# EAGLE schematic LAB_20200609_0_LightSensorWithNPN (EAGLE 9.3.2)
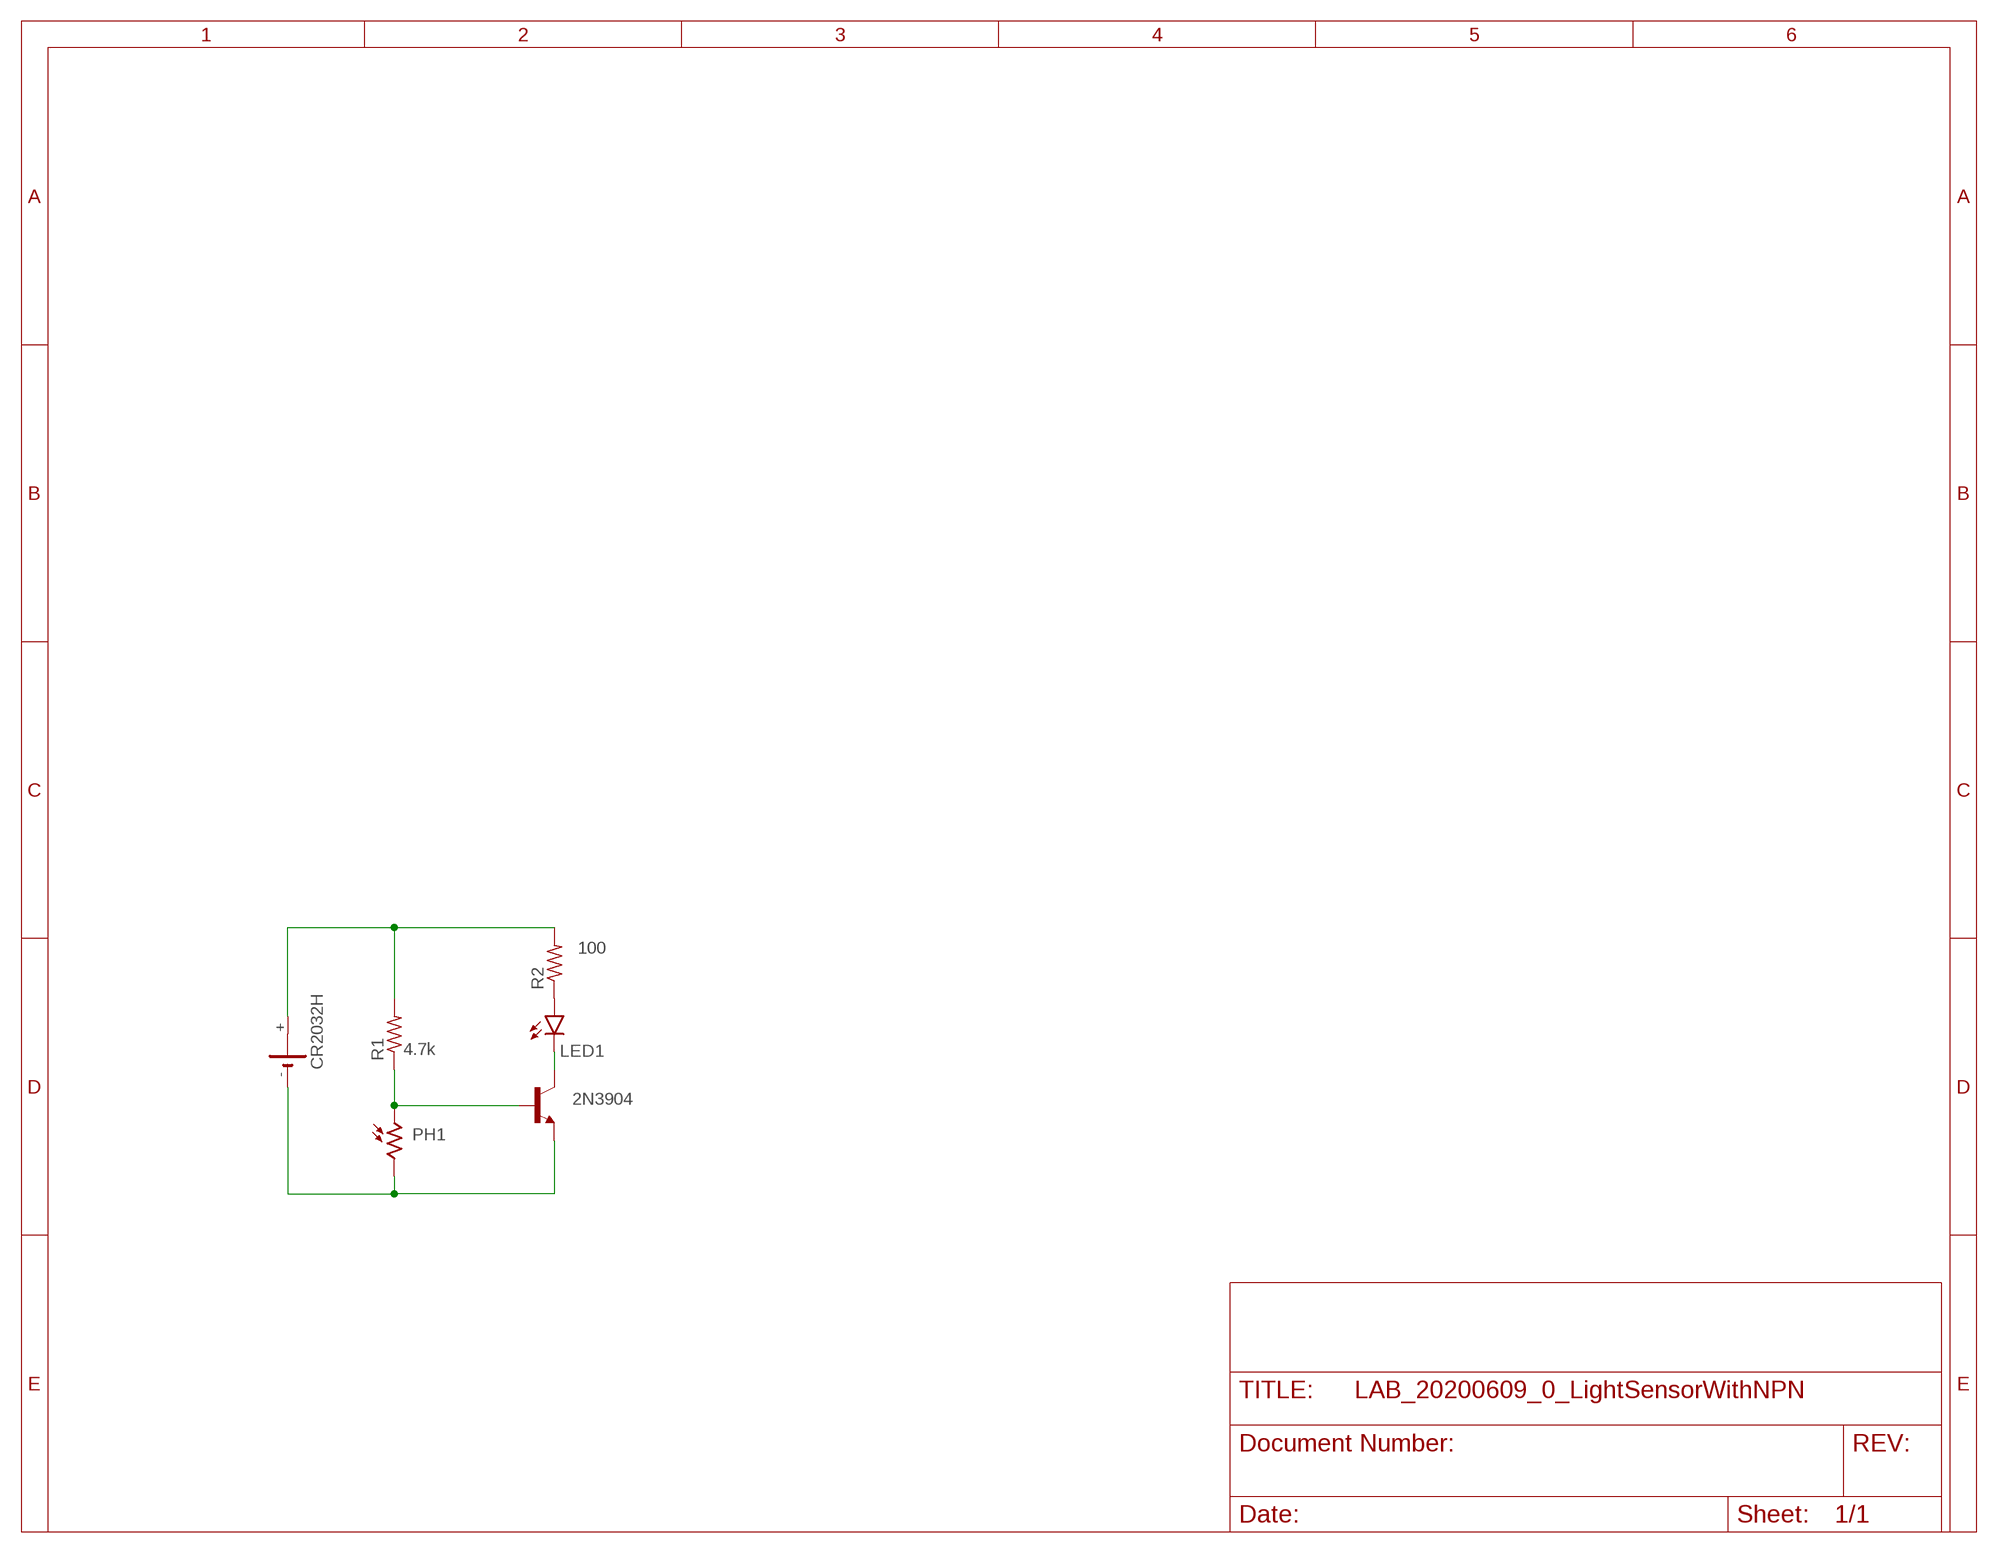
[diagram p0: schematic, sheet 1]

## Parts
G1  CR2032H  [CR2032H]
LED1  LAP4-TOP  [P47F-TOP]
PH1  D1160_12  [D11XX]
R1  4.7k  R-US_0207/12  [0207/12]
R2  100  R-US_0207/12  [0207/12]
T1  2N3904  [TO92]

## Nets
N$1: LED1.C T1.1(C)
N$2: PH1.1 R1.1 T1.2(B)
N$3: LED1.A R2.1
N$4: G1.+ R1.2 R2.2
N$7: G1.- PH1.2 T1.3(E)
Unconnected: G1.+@1(+)

## Library data of the parts
G1 = battery:CR2032H: LI BATTERY Varta
LED1 = led:*P4: PointLED® Enhanced Thinfilm LED TOP & BOTTOM mount LS P47F, LR P47F, LA P47F, LY P47F, LT P4SG, LB P4SG, LW P4SG Source: http://catalog.osram-os.com .. LA_LR_LS_LY_P47F_Pb_free.pdf
PH1 = photo-elements:D11: Photo Sensor Oil Burner Control Applications Source: http://optoelectronics.perkinelmer.com/content/Datasheets/DTS_PhotocellsD1160.pdf
R1 R2 = rcl:R-US_: RESISTOR, American symbol; SPICEPREFIX: R
T1 = transistor:2N3904: NPN TRANSISTOR